# Altium schematic sheet Power Schematic.SchDoc
size A
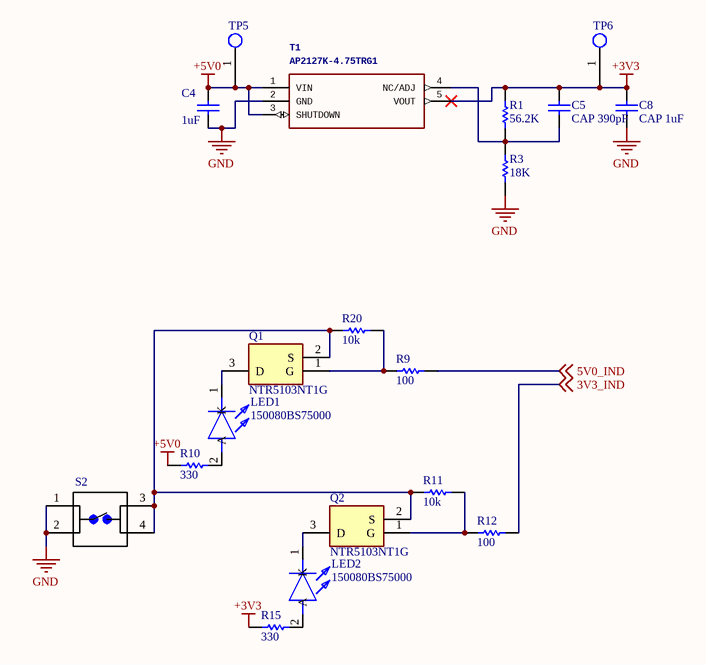
[diagram p0: Power Schematic.SchDoc]

## Parts
C4  1uF  [CAPC0805(2012)75_L]
C5  CAP 390pF  [CAPC0805(2012)75_L]
C8  CAP 1uF  [CAPC0805(2012)75_L]
LED1  150080BS75000  [LEDC2012X80N]
LED2  150080BS75000  [LEDC2012X80N]
Q1  NTR5103NT1G  [SOT95P237X101-3N]
Q2  NTR5103NT1G  [SOT95P237X101-3N]
R1  56.2K  [RESC2013X70X40LL20T20]
R3  18K  [RESC2013X70X40LL20T20]
R9  100  [RESC2013X70X40LL20T20]
R10  330  [RESC2013X70X40LL20T20]
R11  10k  [RESC2013X70X40LL20T20]
R12  100  [RESC2013X70X40LL20T20]
R15  330  [RESC2013X70X40LL20T20]
R20  10k  [RESC2013X70X40LL20T20]
S2  1825910-7  [Switch 6mm 24V (NO)]  (value not drawn)
T1  AP2127K-4.75TRG1  [SOT95P282X145-5N]
TP5  Test Point  [Test Point Through-hole]  (value not drawn)
TP6  Test Point  [Test Point Through-hole]  (value not drawn)

## Nets
+3V3: C5.2 C8.2 R1.1 R15.1 T1.5(VOUT) TP6.1
+5V0: C4.2 R10.2 T1.1(VIN) T1.3(SHUTDOWN) TP5.1
GND: C4.1 C8.1 R3.2 S2.1 S2.2 T1.2(GND)
3V3_IND: R12.1 ; off-sheet 3V3_IND
5V0_IND: R9.1 ; off-sheet 5V0_IND
NetC5_1: C5.1 R1.2 R3.1 T1.4(NC/ADJ)
NetLED1_1: LED1.1(K) Q1.3(D)
NetLED1_2: LED1.2(A) R10.1
NetLED2_1: LED2.1(K) Q2.3(D)
NetLED2_2: LED2.2(A) R15.2
NetQ1_1: Q1.1(G) R9.2 R20.1
NetQ1_2: Q1.2(S) Q2.2(S) R11.2 R20.2 S2.3 S2.4
NetQ2_1: Q2.1(G) R11.1 R12.2

## Notes on the sheet
- Title
- Size:
- Date:
- A
- Number:
- Time:
- Revision:
- Sheet
- of
- File:

## Library data of the parts
C4 C5 C8 = CMP-1036-00339-1: CAP 2.7pF 50V ±0.1pF 0805 (2012 Metric) Thickness 0.75mm SMD; Case-EIA: 0805; Case-Metric: 2012; Tolerance: Â±0.1pF; Rated Voltage: 50 V; Value: 2.7pF; Max Thickness: 0.75 mm; Technology: SMT
LED1 LED2 = 150080BS75000: LED; Manufacturer_Name: Wurth Elektronik; Datasheet Link: https://katalog.we-online.com/led/datasheet/150080BS75000.pdf; Height: 0.8mm; Manufacturer_Part_Number: 150080BS75000; Mouser Part Number: 710-150080BS75000; Mouser Price/Stock: https://www.mouser.com/Search/Refine.aspx?Keyword=710-150080BS75000; RS Part Number: 8154228P; RS Price/Stock: http://uk.rs-online.com/web/p/products/8154228P
Q1 Q2 = NTR5103NT1G: N-MOSFET; Manufacturer_Name: ON Semiconductor; Datasheet Link: https://componentsearchengine.com/Datasheets/1/NTR5103NT1G.pdf; Height: 1.01mm; Manufacturer_Part_Number: NTR5103NT1G; Mouser Part Number: 863-NTR5103NT1G; Mouser Price/Stock: https://www.mouser.com/Search/Refine.aspx?Keyword=863-NTR5103NT1G; RS Part Number: 1841331; RS Price/Stock: http://uk.rs-online.com/web/p/products/1841331
R1 R3 R9-R12 R15 R20 = CMP-2001-04440-2: RES SMD 150K OHM 1% 1/8W 0805; Manufacturer: Panasonic; Part Number: ERJ-6ENF1503V; Datasheet: http://industrial.panasonic.com/cdbs/www-data/pdf/RDA0000/AOA0000C86.pdf
S2 = Switch 6mm 24V (NO): FSM4JAH=6MM TACT SWITCH, HIGH TEMP; MF: TE Connectivity; Contact_Current_Rating: 50 mA; Configuration_Pole-Throw: Single Pole - Single Throw; Package: None; Digi-Key_Part_Number: 450-1804-ND; Digi-Key_Purchase_URL: https://www.digikey.com/product-detail/en/te-connectivity-alcoswitch-switches/1825910-7/450-1804-ND/1731414?utm_source=snapeda&utm_medium=aggregator&utm_campaign=symbol; MP: 1825910-7; SnapEDA_Link: https://www.snapeda.com/parts/1825910-7/TE%20Connectivity%20ALCOSWITCH%20Switches/view-part/?ref=snap; EU_RoHS_Compliance: Compliant; TE_purchase_URL: https://www.te.com/usa-en/product-1825910-7.html?te_bu=Cor&te_type=disp&te_campaign=seda_glo_cor-seda-global-disp-prtnr-fy19-seda-model-bom-cta_sma-317_1&elqCampaignId=32493; Value: *
T1 = AP2127K-4.75TRG1: LDO Voltage Regulators 300mA CMOS LDO 2.5V to 6VSource:  Datasheet; Manufacturer_Name: Diodes Inc.; GateName_1: G$1; SymbolName_1: AP2127K-4.75TRG1; LibraryName: AP2127K-4.75TRG1; DeviceSetName: AP2127K-4.75TRG1; Package: SOT95P282X145-5N; Manufacturer_Part_Number: AP2127K-4.75TRG1; Height: 1.45mm